# Altium schematic sheet ADS131A04.SchDoc
size A4; SheetNumber: 2; SheetTotal: 2
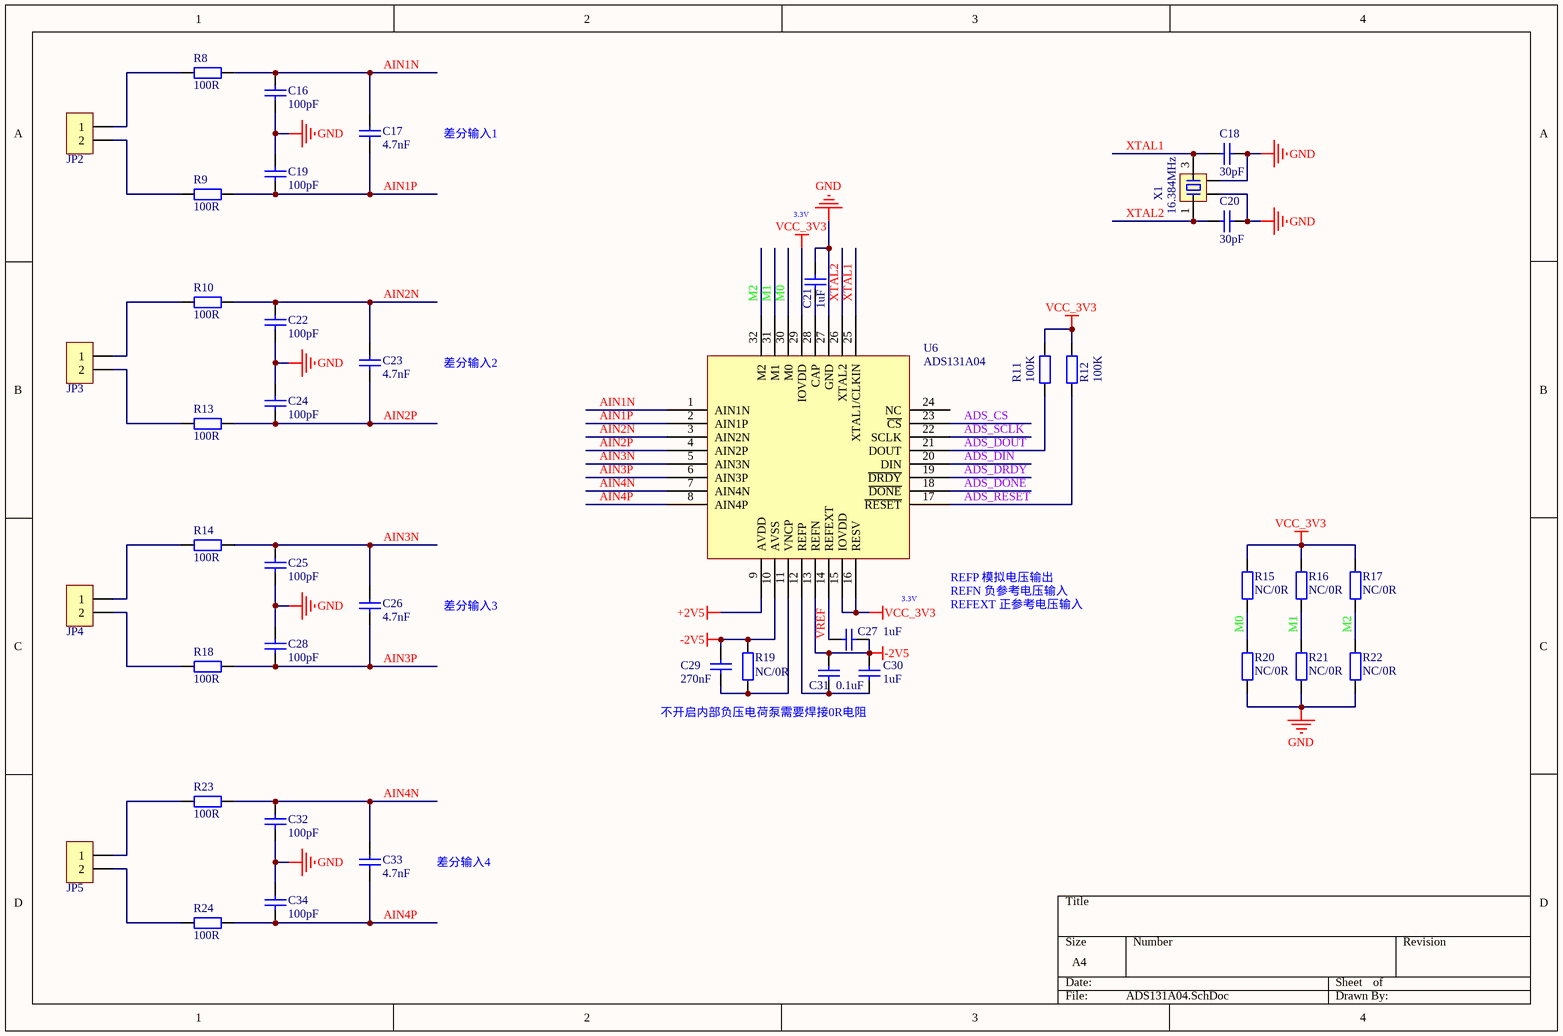
[diagram p0: ADS131A04.SchDoc]

## Parts
C16  100pF  [C0402_L]
C17  4.7nF  [C0402_L]
C18  30pF  [C0402_L]
C19  100pF  [C0402_L]
C20  30pF  [C0402_L]
C21  1uF  [C0402_L]
C22  100pF  [C0402_L]
C23  4.7nF  [C0402_L]
C24  100pF  [C0402_L]
C25  100pF  [C0402_L]
C26  4.7nF  [C0402_L]
C27  1uF  [C0402_L]
C28  100pF  [C0402_L]
C29  270nF  [C0402_L]
C30  1uF  [C0402_L]
C31  0.1uF  [C0402_L]
C32  100pF  [C0402_L]
C33  4.7nF  [C0402_L]
C34  100pF  [C0402_L]
JP2  HDR-1X2  [HDR2.54-WS-2P]  (value not drawn)
JP3  HDR-1X2  [HDR2.54-WS-2P]  (value not drawn)
JP4  HDR-1X2  [HDR2.54-WS-2P]  (value not drawn)
JP5  HDR-1X2  [HDR2.54-WS-2P]  (value not drawn)
R8  100R  [R0402_L]
R9  100R  [R0402_L]
R10  100R  [R0402_L]
R11  100K  [R0402_L]
R12  100K  [R0402_L]
R13  100R  [R0402_L]
R14  100R  [R0402_L]
R15  NC/0R  [R0402_L]
R16  NC/0R  [R0402_L]
R17  NC/0R  [R0402_L]
R18  100R  [R0402_L]
R19  NC/0R  [R0402_L]
R20  NC/0R  [R0402_L]
R21  NC/0R  [R0402_L]
R22  NC/0R  [R0402_L]
R23  100R  [R0402_L]
R24  100R  [R0402_L]
U6  ADS131A04  [TQFP32 5x5_L]
X1  16.384MHz  [XTAL-3225-4P]

## Nets
+2V5: U6.9(AVDD)
-2V5: C27.2 C29.2 C30.2 C31.2 R19.2 U6.10(AVSS) U6.13(REFN)
GND: C16.1 C18.2 C19.2 C20.2 C21.2 C22.1 C24.2 C25.1 C28.2 C32.1 C34.2 R20.1 R21.1 R22.1 U6.27(GND) X1.2 X1.4
VCC_3V3: R11.2 R12.2 R15.2 R16.2 R17.2 U6.15(IOVDD) U6.16(RESV) U6.29(IOVDD)
ADS_CS: U6.23(~{CS})
ADS_DIN: U6.20(DIN)
ADS_DONE: U6.18(~{DONE})
ADS_DOUT: R11.1 U6.21(DOUT)
ADS_DRDY: U6.19(~{DRDY})
ADS_RESET: R12.1 U6.17(~{RESET})
ADS_SCLK: U6.22(SCLK)
AIN1N: C16.2 C17.2 R8.2 U6.1(AIN1N)
AIN1P: C17.1 C19.1 R9.2 U6.2(AIN1P)
AIN2N: C22.2 C23.2 R10.2 U6.3(AIN2N)
AIN2P: C23.1 C24.1 R13.2 U6.4(AIN2P)
AIN3N: C25.2 C26.2 R14.2 U6.5(AIN3N)
AIN3P: C26.1 C28.1 R18.2 U6.6(AIN3P)
AIN4N: C32.2 C33.2 R23.2 U6.7(AIN4N)
AIN4P: C33.1 C34.1 R24.2 U6.8(AIN4P)
M0: R15.1 R20.2 U6.30(M0)
M1: R16.1 R21.2 U6.31(M1)
M2: R17.1 R22.2 U6.32(M2)
VREF: C27.1 U6.14(REFEXT)
XTAL1: C18.1 U6.25(XTAL1/CLKIN) X1.3
XTAL2: C20.1 U6.26(XTAL2) X1.1
NetC21_1: C21.1 U6.28(CAP)
NetC29_1: C29.1 R19.1 U6.11(VNCP)
NetC30_1: C30.1 C31.1 U6.12(REFP)
NetJP2_1: JP2.1 R8.1
NetJP2_2: JP2.2 R9.1
NetJP3_1: JP3.1 R10.1
NetJP3_2: JP3.2 R13.1
NetJP4_1: JP4.1 R14.1
NetJP4_2: JP4.2 R18.1
NetJP5_1: JP5.1 R23.1
NetJP5_2: JP5.2 R24.1

Not connected (* = marked no-connect by the designer): U6 24(NC)

## Notes on the sheet
- 差分输入1
- 3.3V
- 差分输入2
- (near U6) REFP 模拟电压输出
- 差分输入3
- (near U6) 3.3V
- (near U6) REFN 负参考电压输入
- REFEXT 正参考电压输入
- 不开启内部负压电荷泵需要焊接0R电阻
- 差分输入4

## Library data of the parts
C16-C34 = C: 贴片电容; BOM名称: 无极性贴片电容; 联系卖家，免费查找封装: 唯一出售店铺网址https://shop463601444.taobao.com
JP2-JP5 = Header 2: 2P接插件; 封装库来自淘宝卖家 ID：黄晶宝石: 其他店铺购入均为盗版假冒封装库; 联系卖家，免费查找封装: 唯一出售店铺网址https://shop463601444.taobao.com; BOM名称: 2P接插件
R8-R24 = R: 贴片电阻; 联系卖家，免费查找封装: 唯一出售店铺网址https://shop463601444.taobao.com; BOM名称: 贴片电阻
U6 = ADS131A04: 4通道差分24位ADC
X1 = XTAL-4P: 4脚无源晶振(谐振器）; 联系卖家，免费查找封装: 唯一出售店铺网址https://shop463601444.taobao.com; BOM名称: 4脚无源晶振(谐振器）